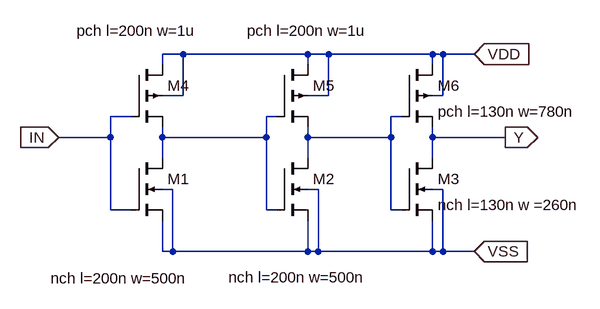
[diagram p0: schematic SLOW_INV.asc]
SLOW_INV.asc, the LTspice schematic file:
Version 4.1
SHEET 1 880 680
WIRE 128 32 96 32
WIRE 320 32 128 32
WIRE 352 32 320 32
WIRE 512 32 352 32
WIRE 528 32 512 32
WIRE 576 32 528 32
WIRE 96 48 96 32
WIRE 320 48 320 32
WIRE 512 48 512 32
WIRE 128 96 128 32
WIRE 128 96 96 96
WIRE 352 96 352 32
WIRE 352 96 320 96
WIRE 528 96 528 32
WIRE 528 96 512 96
WIRE 48 128 16 128
WIRE 272 128 256 128
WIRE 464 128 448 128
WIRE 16 160 16 128
WIRE 16 160 -64 160
WIRE 96 160 96 144
WIRE 256 160 256 128
WIRE 256 160 96 160
WIRE 320 160 320 144
WIRE 448 160 448 128
WIRE 448 160 320 160
WIRE 512 160 512 144
WIRE 624 160 512 160
WIRE 96 192 96 160
WIRE 320 192 320 160
WIRE 512 192 512 160
WIRE 112 240 96 240
WIRE 336 240 320 240
WIRE 528 240 512 240
WIRE 16 272 16 160
WIRE 48 272 16 272
WIRE 256 272 256 160
WIRE 272 272 256 272
WIRE 448 272 448 160
WIRE 464 272 448 272
WIRE 96 336 96 288
WIRE 112 336 112 240
WIRE 112 336 96 336
WIRE 320 336 320 288
WIRE 320 336 112 336
WIRE 336 336 336 240
WIRE 336 336 320 336
WIRE 512 336 512 288
WIRE 512 336 336 336
WIRE 528 336 528 240
WIRE 528 336 512 336
WIRE 576 336 528 336
FLAG -64 160 IN
IOPIN -64 160 In
FLAG 624 160 Y
IOPIN 624 160 Out
FLAG 576 32 VDD
IOPIN 576 32 In
FLAG 576 336 VSS
IOPIN 576 336 In
SYMBOL lib\\sym\\nmos4 48 192 R0
WINDOW 3 -124 185 Left 2
SYMATTR Value nch l=200n w=500n
SYMATTR InstName M1
SYMATTR Value2 l=600n w=500n
SYMBOL lib\\sym\\nmos4 272 192 R0
WINDOW 3 -74 184 Left 2
SYMATTR Value nch l=200n w=500n
SYMATTR InstName M2
SYMATTR Value2 l=600n w=500n
SYMBOL lib\\sym\\nmos4 464 192 R0
SYMATTR InstName M3
SYMATTR Value nch l=130n w =260n
SYMATTR Value2 l=150n w=260n
SYMBOL pmos4 48 48 R0
WINDOW 3 -84 -52 Left 2
SYMATTR Value pch l=200n w=1u
SYMATTR InstName M4
SYMATTR Value2 l=600n w=1.5u
SYMBOL pmos4 272 48 R0
WINDOW 3 -46 -52 Left 2
SYMATTR Value pch l=200n w=1u
SYMATTR InstName M5
SYMATTR Value2 l=600n w=1.5u
SYMBOL pmos4 464 48 R0
SYMATTR InstName M6
SYMATTR Value pch l=130n w=780n
SYMATTR Value2 l=150n w=260n

The netlist it stands for:
* SLOW_INV.asc
M1 N001 IN VSS VSS nch l=200n w=500n l=600n w=500n
M2 N002 N001 VSS VSS nch l=200n w=500n l=600n w=500n
M3 Y N002 VSS VSS nch l=130n w =260n l=150n w=260n
M4 VDD IN N001 VDD pch l=200n w=1u l=600n w=1.5u
M5 VDD N001 N002 VDD pch l=200n w=1u l=600n w=1.5u
M6 VDD N002 Y VDD pch l=130n w=780n l=150n w=260n
.model NMOS NMOS
.model PMOS PMOS
.lib standard.mos
.backanno
.end